# EAGLE design PapraFanBox_v0.1 (EAGLE 9.6.2)
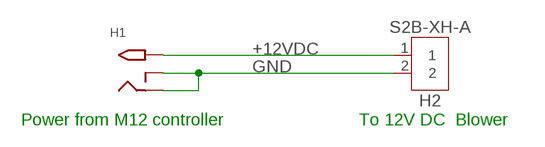
[diagram p0: schematic, sheet 1]

## Parts
H1  PJ-066A  [DCJACK-PJ-066A]
H2  S2B-XH-A  [S2B-XH-A]

## Nets
+12VDC: H1.PWR(TIP) H2.1
GND: H1.GND(RING) H1.GNDBREAK(RING_SW) H2.2

## Notes on the sheet
- Power from M12 controller | To 12V DC  Blower

## Library data of the parts
H1 = PC-LIB:PJ-066A
H2 = Connector:S2B-XH-A: CONN HEADER R/A 2POS 2.5MM Manufacturer's datasheet <http://www.jst-mfg.com/product/pdf/eng/eXH.pdf>; CREATED_BY: PCBLayout.com; DIGIKEY_PART_NUMBER: 455-2257-ND; MANUFACTURER: JST Sales America Inc.; MPN: S2B-XH-A(LF)(SN)

## Board
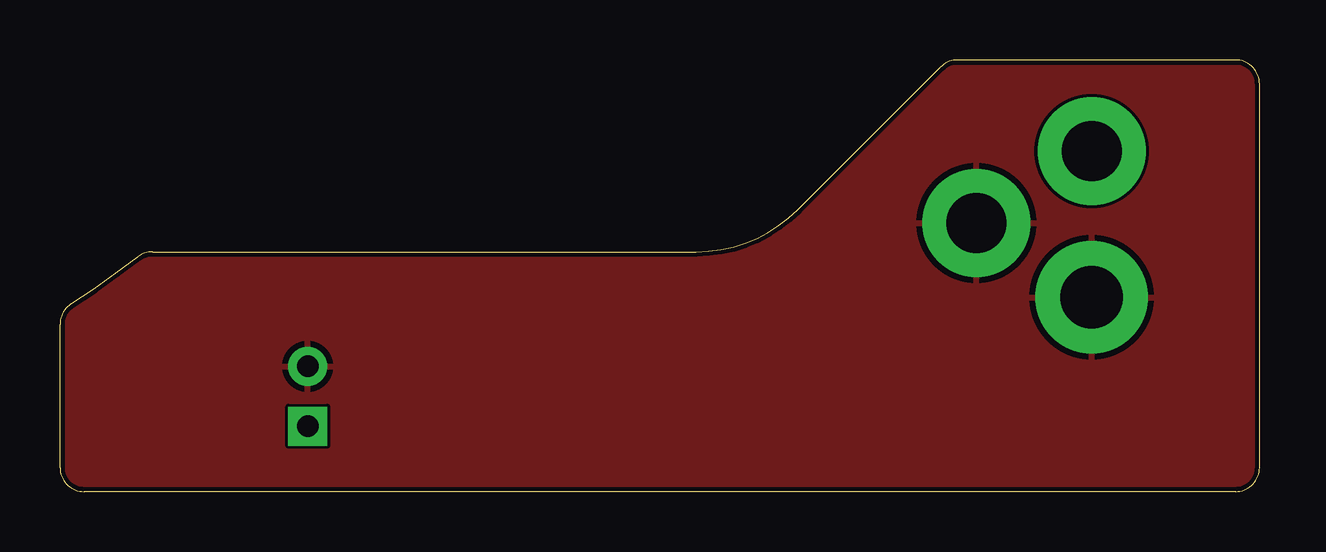
[diagram p1: board, top side]
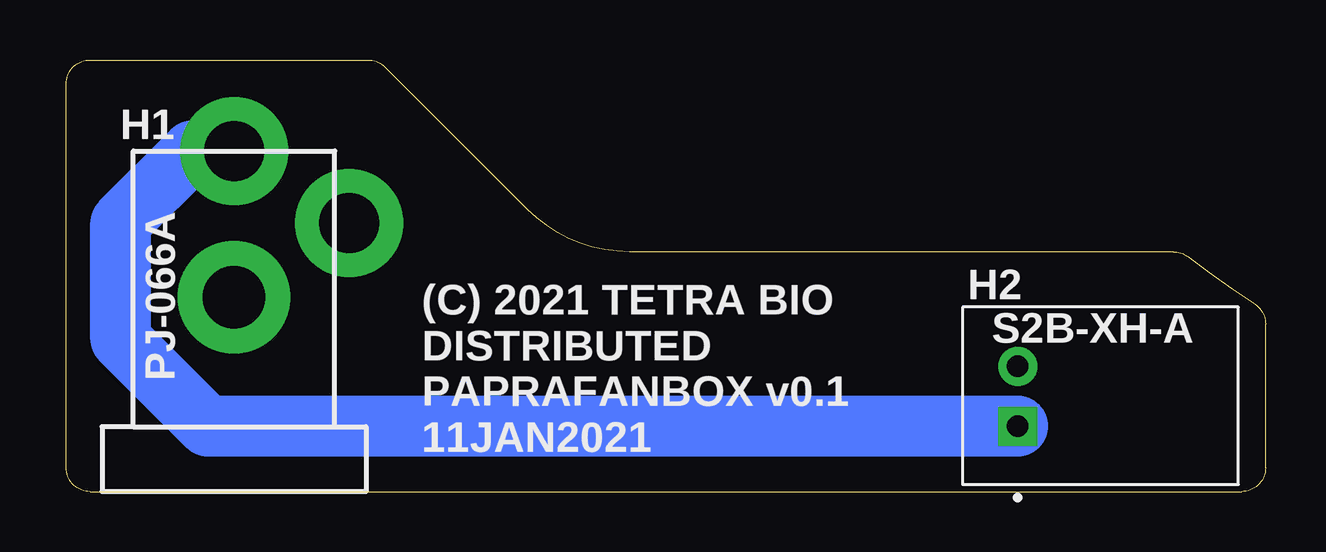
[diagram p2: board, bottom side, seen from below]

Size 50 x 18 mm. Coordinates in mm from the lower left corner, seen from the top.
Outline: 3.86,10 arc37 3.25,9.8 arc-4 0.45,7.82 arc57 0,6.98 0,1 arc90 1,0 49,0 arc90 50,1 50,17 arc90 49,18 37.41,18 arc45 36.71,17.71 30.76,11.76 arc-45 26.52,10 3.86,10
Copper layers (1*16): Top 0.035mm / dielectric 1.6mm / Bottom 0.035mm
Design rules "jlcpcb-2layers": minimum track width 5mil, minimum drill 0.3mm, track to track 5mil, track to pad 5mil, pad to pad 5mil, via to via 5mil, smd to smd 5mil, copper to edge 0.2mm, drill to drill 6mil, minimum pad ring 10mil, minimum via ring 3mil, stop-mask expansion 4mil, vias tented up to drill 0mil, thermal gap 10mil

### Footprints (pad centres in the part's own frame; a part is rotated, then mirrored left to right if it is on the bottom)
DCJACK-PJ-066A = drill 2.6: GND 0,8.1 | drill 2.5: GNDBREAK 4.8,11.2; PWR 0,14.2
S2B-XH-A = drill 0.9 square: 1 0,0 | drill 0.9: 2 2.5,0

### Placement (x,y rotation side)
H1  43,0 0 bottom
H2  10.33,2.72 90 bottom

### Tracks (layer width: path | path; a pad name or v marks a point on that pad's centre or on a via)
+12VDC
  Bottom 2.54: H2.1 44.09,2.72 47.71,6.35 47.71,11.21 44.73,14.2 H1.PWR
GND
  pour Top: 53.85,20.83 -2.41,20.83 -2.41,-4.45 53.85,-4.45

### Text on the board
bPlace: (C) 2021 TETRA BIO / DISTRIBUTED / PAPRAFANBOX v0.1 / 11JAN2021